# EAGLE design aspirin (EAGLE 6.1)
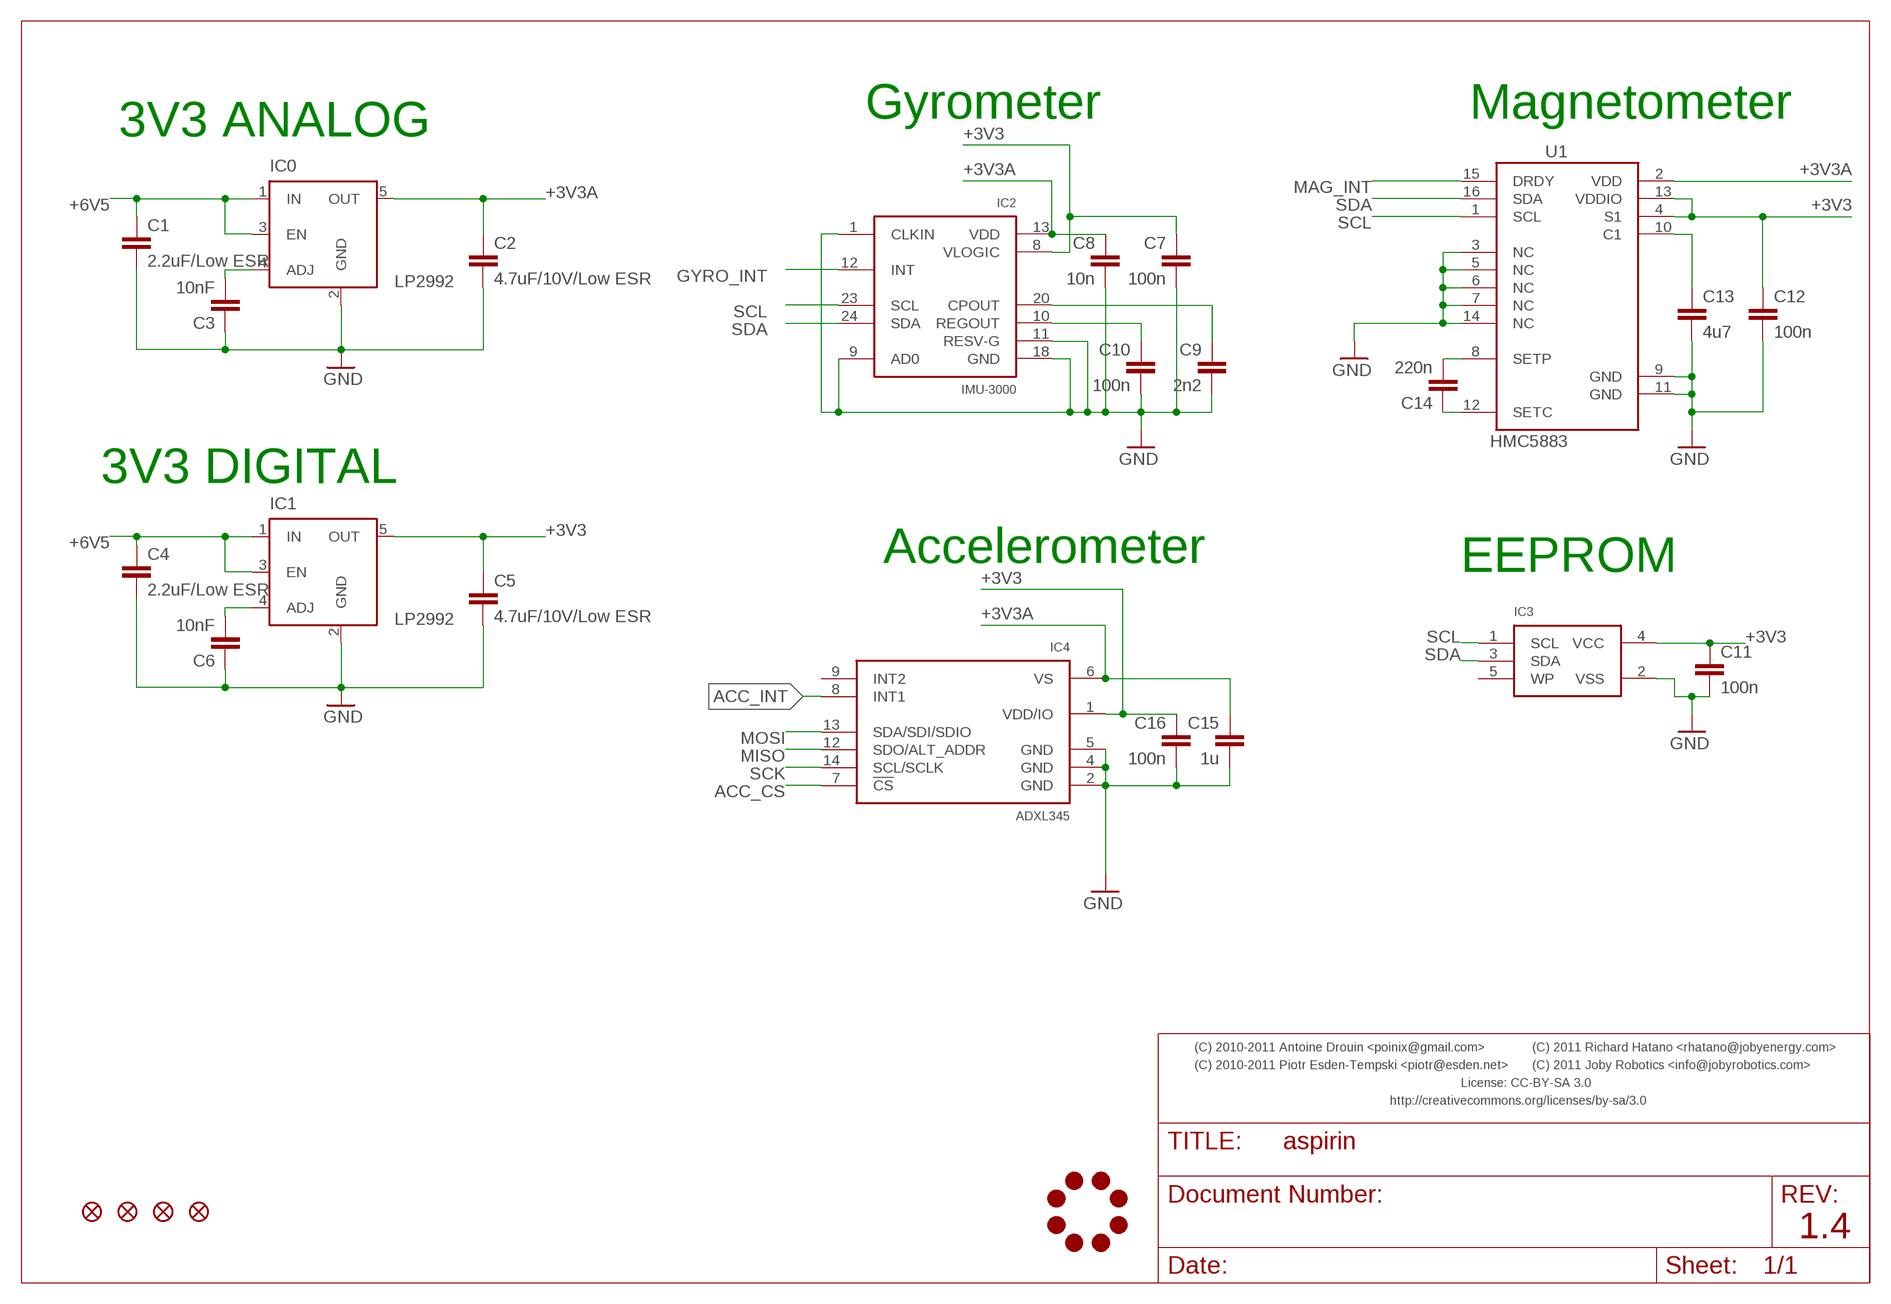
[diagram p0: schematic, sheet 1]

## Parts
C1  2.2uF/Low ESR  CAPACITOR-0603  [0603-CAP]
C2  4.7uF/10V/Low ESR  CAPACITOR-0402  [0402-CAP]
C3  10nF  CAPACITOR-0402  [0402-CAP]
C4  2.2uF/Low ESR  CAPACITOR-0603  [0603-CAP]
C5  4.7uF/10V/Low ESR  CAPACITOR-0402  [0402-CAP]
C6  10nF  CAPACITOR-0402  [0402-CAP]
C7  100n  CAPACITOR-0402  [0402-CAP]
C8  10n  CAPACITOR-0402  [0402-CAP]
C9  2n2  CAPACITOR-0402  [0402-CAP]
C10  100n  CAPACITOR-0402  [0402-CAP]
C11  100n  CAPACITOR-0402  [0402-CAP]
C12  100n  CAPACITOR-0402  [0402-CAP]
C13  4u7  CAPACITOR-0402  [0402-CAP]
C14  220n  CAPACITOR-0402  [0402-CAP]
C15  1u  CAPACITOR-0402  [0402-CAP]
C16  100n  CAPACITOR-0402  [0402-CAP]
IC0  LP2992  MIC5219BM5  [SOT23-5]
IC1  LP2992  MIC5219BM5  [SOT23-5]
IC2  IMU-3000  ITG-3200-AX  [QFN24-WITH-AXES]
IC3  I2C_EEPROM-SOT23-5  [SOT23-5]
IC4  ADXL345  [LGA-14]
JL2  JOBY_LOGO-6MIL  [JOBY_LOGO_6MIL]
JP1  FIDUCIAL1X2  [FIDUCIAL-1X2]
JP2  FIDUCIAL1X2  [FIDUCIAL-1X2]
JP3  FIDUCIAL1X2  [FIDUCIAL-1X2]
JP4  FIDUCIAL1X2  [FIDUCIAL-1X2]
U1  HMC5883  [PLCC16-HMC5883]

## Nets
+3V3: C5.P$1 C7.P$1 C11.P$1 C12.P$1 C16.P$1 IC1.5(OUT) IC2.8(VLOGIC) IC3.4(VCC) IC4.1(VDD/IO) U1.4(S1) U1.13(VDDIO)
+3V3A: C2.P$1 C8.P$1 C15.P$1 IC0.5(OUT) IC2.13(VDD) IC4.6(VS) U1.2(VDD)
+6V5: C1.P$1 C4.P$1 IC0.1(IN) IC0.3(EN) IC1.1(IN) IC1.3(EN)
ACC_CS: IC4.7(!CS)
ACC_INT: IC4.8(INT1)
GND: C1.P$2 C2.P$2 C3.P$1 C4.P$2 C5.P$2 C6.P$1 C7.P$2 C8.P$2 C9.P$2 C10.P$2 C11.P$2 C12.P$2 C13.P$2 C15.P$2 C16.P$2 IC0.2(GND) IC1.2(GND) IC2.1(CLKIN) IC2.9(AD0) IC2.11(RESV-G) IC2.18(GND) IC3.2(VSS) IC4.2(GND) IC4.4(GND) IC4.5(GND) U1.3(NC) U1.5(NC) U1.6(NC) U1.7(NC) U1.9(GND) U1.11(GND) U1.14(NC)
GYRO_INT: IC2.12(INT)
MAG_INT: U1.15(DRDY)
MISO: IC4.12(SDO/ALT_ADDR)
MOSI: IC4.13(SDA/SDI/SDIO)
N$1: C9.P$1 IC2.20(CPOUT)
N$2: C10.P$1 IC2.10(REGOUT)
N$3: C13.P$1 U1.10(C1)
N$19: C6.P$2 IC1.4(ADJ)
N$23: C3.P$2 IC0.4(ADJ)
N$34: C14.P$2 U1.8(SETP)
N$48: C14.P$1 U1.12(SETC)
SCK: IC4.14(SCL/SCLK)
SCL: IC2.23(SCL) IC3.1(SCL) U1.1(SCL)
SDA: IC2.24(SDA) IC3.3(SDA) U1.16(SDA)
Unconnected: IC3.5(WP) IC4.9(INT2)

## Notes on the sheet
- Gyrometer | Magnetometer
- 3V3 ANALOG
- 3V3 DIGITAL
- Accelerometer | EEPROM
- (C) 2010-2011 Antoine Drouin <poinix@gmail.com> | (C) 2011 Richard Hatano <rhatano@jobyenergy.com>
- (C) 2010-2011 Piotr Esden-Tempski <piotr@esden.net> | (C) 2011 Joby Robotics <info@jobyrobotics.com>
- License: CC-BY-SA 3.0
- http://creativecommons.org/licenses/by-sa/3.0
- 1.4

## Library data of the parts
C1-C16 = pel_dipol_comp:CAPACITOR
IC0 IC1 = v-reg-micrel:MIC5219BM5: VOLTAGE REGULATOR
IC2 = aspirin:ITG-3200
IC3 = aspirin:I2C_EEPROM
IC4 = aspirin:ADXL345
JL2 = aspirin:JOBY_LOGO
JP1-JP4 = aspirin:FIDUCIAL: Fiducial Alignment Points Various fiducial points for machine vision alignment.
U1 = aspirin:HMC5883

## Board
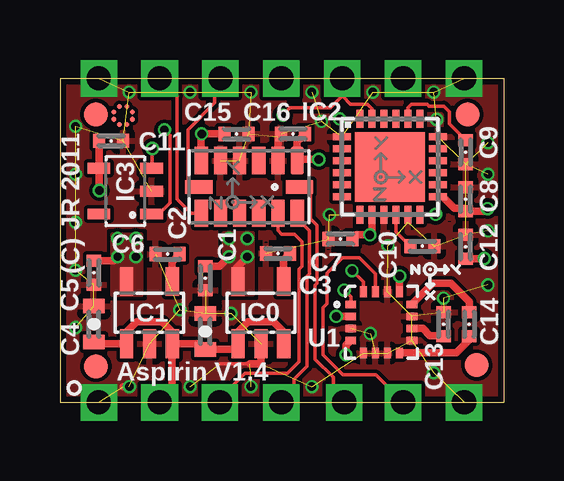
[diagram p1: board, top side]
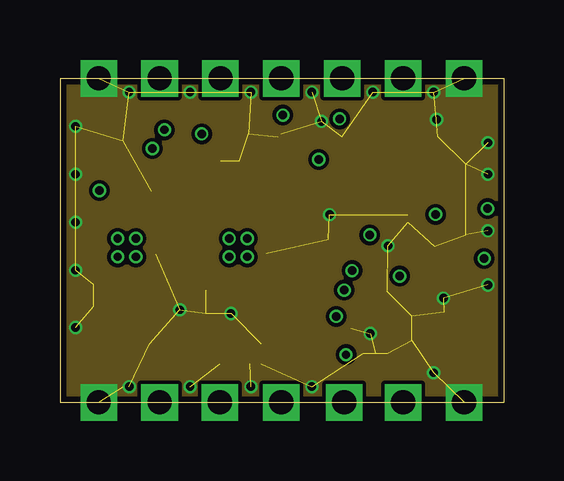
[diagram p2: board, inner layer Route2]
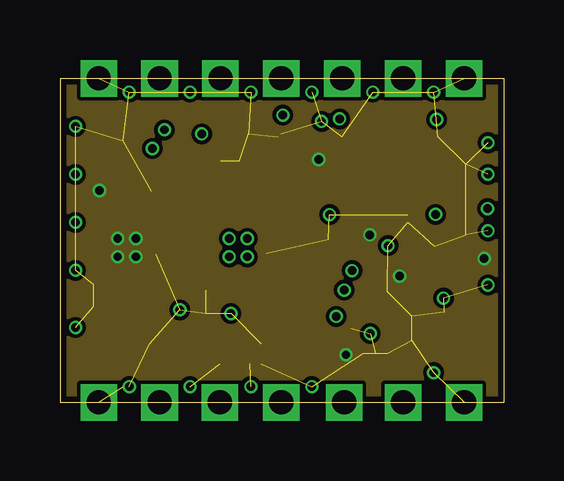
[diagram p3: board, inner layer Route15]
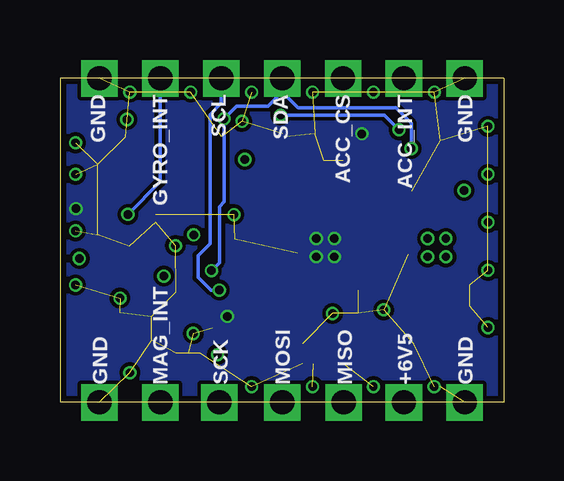
[diagram p4: board, bottom side, seen from below]

Size 18.5 x 13.5 mm. Coordinates in mm from the lower left corner, seen from the top.
Outline: 0,13.5 0,0 18.5,0 18.5,13.5 0,13.5
Copper layers (1*2+15*16): Top 0.035mm / dielectric 0.2mm / Route2 0.035mm / dielectric 1.5mm / Route15 0.035mm / dielectric 0.2mm / Bottom 0.035mm
Design rules: minimum track width 0.15mm, minimum drill 0.35mm, track to track 6mil, track to pad 6mil, pad to pad 6mil, via to via 6mil, smd to smd 6mil, copper to edge 10mil, drill to drill 8mil, minimum pad ring 0.1mm, minimum via ring 0.1mm, stop-mask expansion 4mil, vias tented up to drill 0.35mm, thermal gap 10mil
tRestrict: area 8.5,6.7 to 8.7,6.7; area 11.1,6.3 to 11.2,6.4; area 16.2,7.5 to 16.3,7.5

### Footprints (pad centres in the part's own frame; a part is rotated, then mirrored left to right if it is on the bottom)
0603-CAP = smd 0.6 x 0.9: P$1 -0.75,0; P$2 0.75,0
0402-CAP = smd 0.5 x 0.6: P$1 -0.5,0; P$2 0.5,0
SOT23-5 = smd 0.55 x 1.2: 1 -0.95,-1.3; 2 0,-1.3; 3 0.95,-1.3; 4 0.95,1.3; 5 -0.95,1.3
QFN24-WITH-AXES = smd 0.75 x 0.3: 1 -2,1.25; 2 -2,0.75; 3 -2,0.25; 4 -2,-0.25; 5 -2,-0.75; 6 -2,-1.25; 13 2,-1.25; 14 2,-0.75; 15 2,-0.25; 16 2,0.25; 17 2,0.75; 18 2,1.25 | smd 0.3 x 0.75: 7 -1.25,-2; 8 -0.75,-2; 9 -0.25,-2; 10 0.25,-2; 11 0.75,-2; 12 1.25,-2; 19 1.25,2; 20 0.75,2; 21 0.25,2; 22 -0.25,2; 23 -0.75,2; 24 -1.25,2 | smd 2.9 x 2.9: EXP 0,0
SOT23-5' = smd 0.45 x 0.95: 1 0.95,1.1; 2 0,1.1; 3 -0.95,1.1; 4 -0.95,-1.1; 5 0.95,-1.1
LGA-14 = smd 1.145 x 0.55: 1 -1.097,2; 2 -1.097,1.2; 3 -1.097,0.4; 4 -1.097,-0.4; 5 -1.097,-1.2; 6 -1.097,-2; 8 1.097,-2; 9 1.097,-1.2; 10 1.097,-0.4; 11 1.097,0.4; 12 1.097,1.2; 13 1.097,2 | smd 0.55 x 1.145: 7 0,-2.098; 14 0,2.098
JOBY_LOGO_6MIL = smd 0.203 x 0.203: 1 -0.152,0.381; 2 0.152,0.381; 3 0.381,0.152; 4 0.381,-0.152; 5 0.152,-0.381; 6 -0.152,-0.381; 7 -0.381,-0.152; 8 -0.381,0.152
FIDUCIAL-1X2 = smd 1 x 1: 1 0,0
PLCC16-HMC5883 = smd 0.45 x 0.3: 1 -1.275,0.75; 2 -1.275,0.25; 3 -1.275,-0.25; 4 -1.275,-0.75; 9 1.275,-0.75; 10 1.275,-0.25; 11 1.275,0.25; 12 1.275,0.75 | smd 0.3 x 0.45: 5 -0.75,-1.275; 6 -0.25,-1.275; 7 0.25,-1.275; 8 0.75,-1.275; 13 0.75,1.275; 14 0.25,1.275; 15 -0.25,1.275; 16 -0.75,1.275

### Placement (x,y rotation side)
C1  6.06,2.95 90 top
C2  6.06,5.16 270 top
C3  9.1,6.2 0 top
C4  1.42,3.26 90 top
C5  1.42,5.39 270 top
C6  4.5,6.17 0 top
C7  11.69,6.8 180 top
C8  16.92,8.47 90 top
C9  16.92,10.42 270 top
C10  15.11,6.5 0 top
C11  2.13,10.9 0 top
C12  16.92,6.48 90 top
C13  16,3.26 90 top
C14  17.07,3.26 270 top
C15  7.36,11.18 0 top
C16  9.72,11.18 180 top
DRILEGEND  [DRILEGEND]  -0.41,-7.39 0 top  (outside the outline)
IC0  8.38,3.73 0 top
IC1  3.73,3.73 0 top
IC2  13.76,9.81 0 top
IC3  [SOT23-5']  2.73,8.8 270 top
IC4  7.89,8.97 270 top
JL2  2.63,11.95 0 top
JP1  1.5,12 0 top
JP2  17,12 0 top
JP3  1.5,1.5 0 top
JP4  17.38,1.55 0 top
U1  13.4,3.33 0 top

### Tracks (layer width: path | path; a pad name or v marks a point on that pad's centre or on a via)
+3V3  (via drill 0.35)
  Top 0.305: v10.79,10.12 9.94,10.12 IC4.1 9.89,10.86 C16.P$1 | v1.64,8.82 1.64,9.73 IC3.4 1.63,10.89 C11.P$1 | C7.P$1 12.37,6.98 v12.92,6.98 13.01,7.07 IC2.8 | C5.P$1 2.24,5.89 v2.41,6.06 | U1.13 14.16,4.61 v14.16,5.26 | v11.93,1.98 11.93,2.38 U1.4 | C12.P$1 17.68,5.99 v17.69,5.99
  other vias: 3.17,6.06 2.41,6.83 3.17,6.83
  pour Route15: 0,0 19,0 19,13.5 0,13.5
  pour Top (no thermals): 3.4,4.46 2.18,4.46 2.18,7 3.4,7
+3V3A  (via drill 0.35)
  Top 0.305: v7.82,6.06 7.36,5.61 | C2.P$1 6.65,5.66 v7.05,6.06 | IC4.6 5.89,11.16 v5.91,11.18 C15.P$1 | U1.2 v11.53,3.58 v11.52,3.58 | v17.83,8.07 17.73,7.97 C8.P$1 16.92,8.02 16.86,8.08 16.45,8.08 15.97,8.56 IC2.13
  other vias: 7.82,6.83 7.05,6.83
  pour Bottom: 18.5,0 18.5,13.5 0,13.5 0,0
  pour Top (no thermals): 8.04,4.48 6.83,4.48 6.83,7.07 8.04,7.07
+6V5  (via drill 1.02)
  Top 0.305: IC0.3 9.33,2.94 8.92,3.35 7.85,3.35 7.43,2.94 IC0.1 7.2,2.2 C1.P$1 5.83,2.43 IC1.3 | IC1.3 4.68,2.94 4.27,3.35 3.2,3.35 2.78,2.94 IC1.1 1.49,2.43 C4.P$1 | IC1.3 4.68,0.53 v4.16,0
ACC_CS  (via drill 1.02)
  Top 0.152: v6.7,13.5 6.46,13.26 6.46,12.47 5.33,11.35 5.33,9.16 5.52,8.97 IC4.7
ACC_INT  (via drill 1.02)
  Top 0.152: IC4.8 5.47,7.88 4.89,8.46 4.89,12.76 v4.16,13.5
GND  (via drill 0.35, 1.02)  (62 unrouted)
  Top 0.152: 6.68,1.6 7.93,1.6 | 14.51,7.51 IC2.11
  Top 0.305: v2.89,0.65 2.63,0.65 | IC0.2 8.38,1.6 7.93,1.6 | C16.P$2 9.09,11.05 IC4.2
  other vias: 5,3.85 7.13,3.7 17.85,9.5 17.85,10.81 17.85,7.14 17.85,4.89 0.65,3.12 0.65,5.5 0.65,7.5 0.65,9.5 0.65,11.5 2.89,12.92 5.43,12.92 7.97,12.92 13.05,12.92 15.59,12.92 13.68,6.52 7.97,0.65 10.51,0.65 1.62,0 5.43,0.65 1.62,13.5 16.86,13.5 16.86,0 10.51,12.92 11.24,7.82 15.71,11.78 10.91,11.7 15.99,4.34 12.95,2.86 15.59,1.23
  pour Top (rank 6): 0,0 18.5,0 18.5,13.5 0,13.5
  pour Route2: 0,0 19,0 19,13.5 0,13.5
GYRO_INT  (via drill 0.35, 1.02)
  Top 0.152: IC2.12 15.65,7.81 v15.67,7.83
  Bottom 0.152: v14.32,13.5 14.32,9.18 v15.67,7.83
MAG_INT  (via drill 1.02)
  Top 0.152: U1.15 13.15,5.36 12.49,6.02 11.78,6.02 11.14,5.38 11.14,4.12 10.96,3.94 10.96,1.98 11.8,1.14 13.17,1.14 v14.32,0
MISO  (via drill 1.02)
  Top 0.152: v6.67,0 6.67,0.15 7.72,1.2 9.49,1.2 9.98,1.68 9.98,5.54 10.1,5.67 10.1,6.69 9.78,7.01 9.25,7.01 9.09,7.16 IC4.12
MOSI  (via drill 1.02)
  Top 0.152: IC4.13 9.89,7.66 10.41,7.14 10.41,5.36 10.3,5.26 10.3,1.5 9.75,0.95 9.75,0.51 v9.24,0
N$1
  Top 0.152: IC2.20 14.51,12.28 14.66,12.42 15.32,12.42 15.39,12.34 16,12.34 16.23,12.12 16.23,11.61 C9.P$1
N$2
  Top 0.152: C10.P$1 14.01,7.11 IC2.10
N$3
  Top 0.305: U1.10 15.13,3.08 15.43,2.77 15.99,2.77 C13.P$1
N$19
  Top 0.305: C6.P$2 4.68,5.86 IC1.4
N$23
  Top 0.305: C3.P$2 9.33,5.94 IC0.4
N$34
  Top 0.305: C14.P$2 17.07,2.6 16.53,2.06 U1.8
N$48
  Top 0.305: U1.12 15.55,4.95 16.3,4.95 17.07,4.18 C14.P$1
SCK  (via drill 1.02)
  Top 0.152: v11.85,0 11.4,0.45 11.4,1.04 10.64,1.8 10.63,1.8 10.63,4.88 10.71,4.96 10.71,7.37 10.44,7.65 10.44,8.83 10.3,8.97 IC4.14
SCL  (via drill 0.35, 1.02)
  Top 0.152: v9.3,11.96 9.6,12.27 11.28,12.27 11.78,12.77 | IC3.1 4.13,7.84 4.59,8.31 4.59,11.12 v4.36,11.35 | 11.78,12.77 v11.78,13.5 | 11.78,12.77 12.12,12.42 12.82,12.42 13.01,12.23 IC2.23 | U1.1 12.13,4.4 v11.85,4.67
  Bottom 0.152: v11.78,13.5 11.78,12.46 12.24,11.99 12.24,6.6 12.65,6.2 12.74,6.11 12.74,5.21 12.21,4.67 v11.85,4.67 | v4.36,11.35 4.97,11.96 v9.3,11.96
SDA  (via drill 0.35, 1.02)
  Top 0.152: IC2.24 v11.66,11.81 | IC3.3 3.85,9.77 v3.85,10.57 | U1.16 12.65,5.02 v12.18,5.49
  Bottom 0.152: 9.24,12.94 9.83,12.34 11.13,12.34 v11.66,11.81 v11.65,11.8 11.65,8.36 11.85,8.15 11.85,5.82 v12.18,5.49 | 9.24,12.94 v9.24,13.5 | v3.85,10.57 3.85,11.63 4.5,12.27 8.57,12.27 9.24,12.94

### Text on the board
tPlace: (C) JR 2011 | Aspirin V1.4
bPlace: GND | ACC_INT | ACC_CS | SDA | SCL | GYRO_INT | GND | GND | +6V5 | MISO | MOSI | SCK | MAG_INT | GND